# Altium schematic sheet energy_router_#2_hybrid.SchDoc
size A4
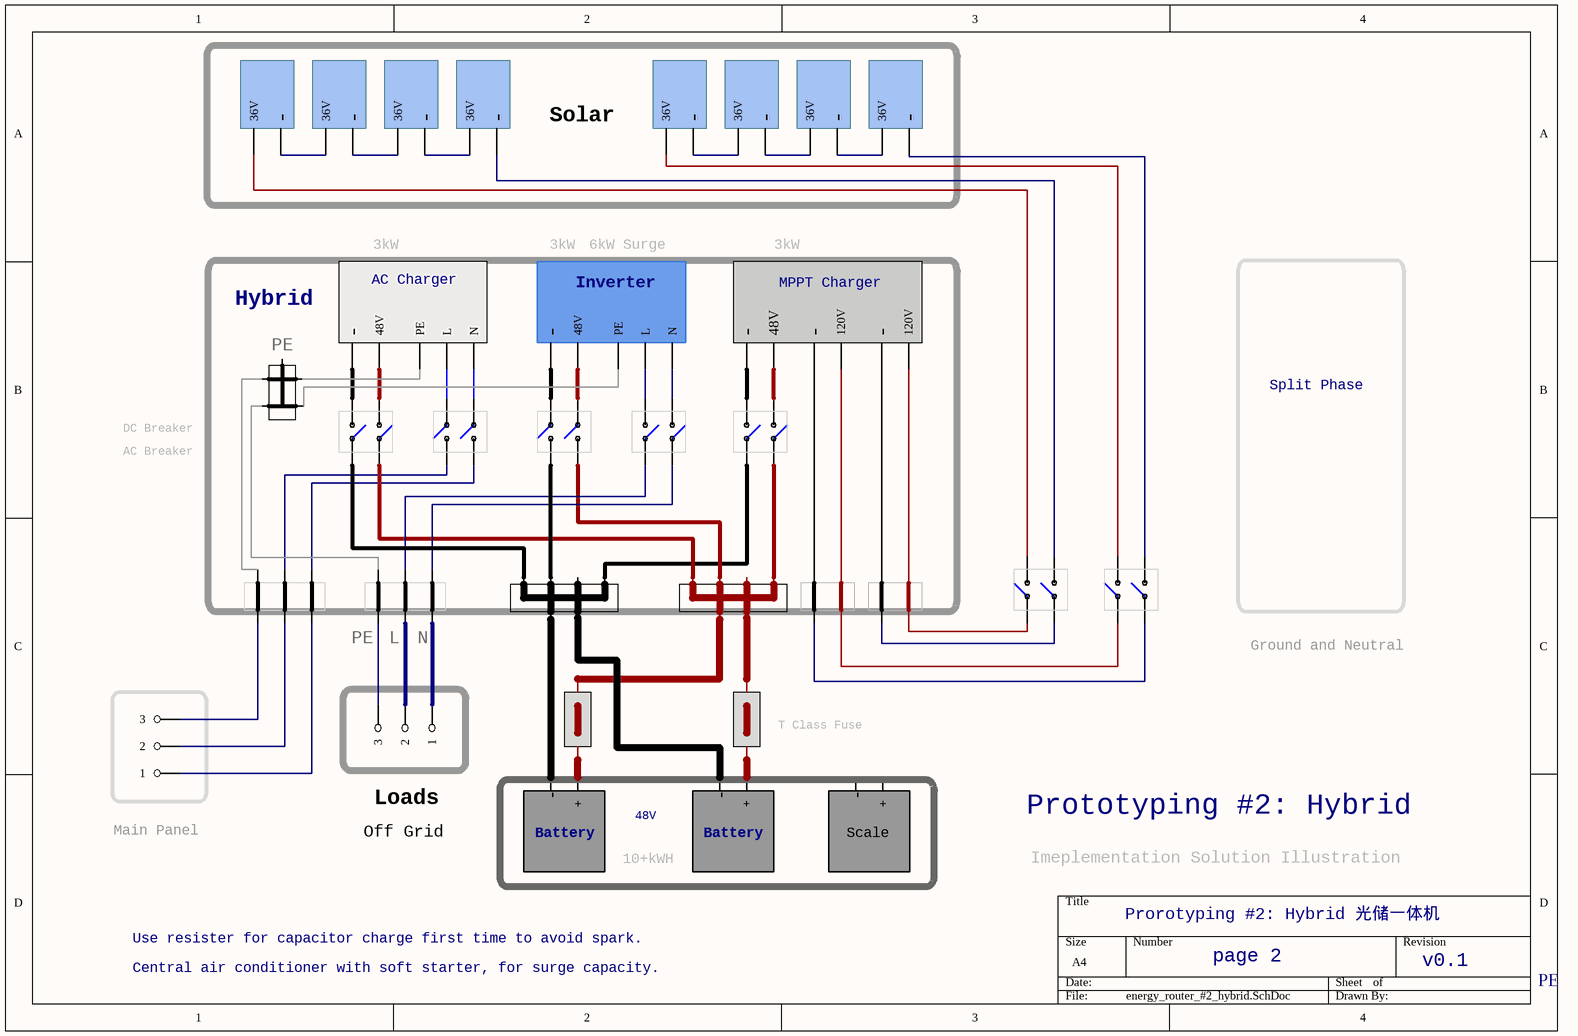
[diagram p0: energy_router_#2_hybrid.SchDoc]

## Parts
(Parts that share a designator on the sheet are numbered #1, #2 ... from top to bottom, then left to right.)
B1022  3_Bus_Bar_Black  (value not drawn)
B1293  3_Bus_Bar_Red  (value not drawn)
Battery1022  48V Battery  (value not drawn)
Battery?  48V Battery  (value not drawn)
F1039  3_Fuse_1_Red  (value not drawn)
I1203  0_Inverter_side  (value not drawn)
JP1102  3 HEADER  (value not drawn)
JP1203  3 HEADER  (value not drawn)
K003  3_Switch_2_box_narrow  (value not drawn)
K039  3_Switch_2_box_reverse_narrow  (value not drawn)
K380  3_Switch_2_box_narrow  (value not drawn)
K946  3_Switch_2_box_reverse_narrow  (value not drawn)
K1023  3_Switch_2_box_reverse_narrow  (value not drawn)
K1039  3_Switch_2_box_reverse_narrow  (value not drawn)
K1043  3_Switch_2_box_reverse_narrow  (value not drawn)
S1023  Solar Panel  (value not drawn)
S1029  Solar Panel  (value not drawn)
S1234  Solar Panel  (value not drawn)
S1704  Solar Panel  (value not drawn)
S1902  Solar Panel  (value not drawn)
S1912  Solar Panel  (value not drawn)
S1923  Solar Panel  (value not drawn)
S1945  Solar Panel  (value not drawn)
Scale  1_BAT_48V  (value not drawn)
T028  3_Bus_Bar_PE  (value not drawn)
T1234  4_Terminal_2_Red_Black  (value not drawn)
T1238  4_Terminal_2_Red_Black  (value not drawn)
U1287  3_Fuse_1_Red  (value not drawn)
U1297  4_Terminal_3  (value not drawn)
U2391  4_Terminal_3  (value not drawn)
U?#1  0_MPPT_Charger_120V_side  (value not drawn)
U?#2  0_AC_Charger_48V_side  (value not drawn)

## Blocks framed on the sheet
Solar: S1023 S1029 S1234 S1704 S1902 S1912 S1923 S1945
Hybrid: B1022 B1293 I1203 K039 K946 K1023 K1039 K1043 T028 T1234 T1238 U1297 U2391 U?#1 U?#2

## Nets
NetB1022_1: B1022.1 K1039.3
NetB1022_2: B1022.2 Battery?.1(-)
NetB1022_3: B1022.3 K1023.2
NetB1022_4: B1022.4 K946.2
NetB1022_6: B1022.6 Battery1022.1(-)
NetB1293_1: B1293.1 K1039.4
NetB1293_2: B1293.2 F1039.1
NetB1293_3: B1293.3 K1023.1
NetB1293_4: B1293.4 K946.1
NetB1293_6: B1293.6 U1287.1
NetBattery1022_2: Battery1022.2(+) U1287.2
NetBattery?_2: Battery?.2(+) F1039.2
NetI1203_1: I1203.1(N) K039.3
NetI1203_2: I1203.2(L) K039.4
NetI1203_3: I1203.3(PE) T028.6
NetI1203_4: I1203.4(-) K1039.1
NetI1203_5: I1203.5(48V) K1039.2
NetJP1102_1: JP1102.1 U2391.2
NetJP1102_2: JP1102.2 U2391.2
NetJP1102_3: JP1102.3 U2391.2
NetJP1203_1: JP1203.1 U1297.2
NetJP1203_2: JP1203.2 U1297.2
NetJP1203_3: JP1203.3 U1297.2
NetK003_1: K003.1 S1023.2(36V)
NetK003_2: K003.2 S1912.1(-)
NetK003_3: K003.3 T1238.1
NetK003_4: K003.4 T1238.1
NetK039_1: K039.1 U1297.1
NetK039_2: K039.2 U1297.1
NetK380_1: K380.1 S1902.2(36V)
NetK380_2: K380.2 S1704.1(-)
NetK380_3: K380.3 T1234.1
NetK380_4: K380.4 T1234.1
NetK946_3: K946.3 U?#1.2(48V)
NetK946_4: K946.4 U?#1.1(-)
NetK1023_3: K1023.3 U?#2.5(48V)
NetK1023_4: K1023.4 U?#2.4(-)
NetK1043_1: K1043.1 U?#2.2(L)
NetK1043_2: K1043.2 U?#2.1(N)
NetK1043_3: K1043.3 U2391.1
NetK1043_4: K1043.4 U2391.1
NetS1023_1: S1023.1(-) S1029.2(36V)
NetS1029_1: S1029.1(-) S1234.2(36V)
NetS1234_1: S1234.1(-) S1912.2(36V)
NetS1704_2: S1704.2(36V) S1945.1(-)
NetS1902_1: S1902.1(-) S1923.2(36V)
NetS1923_1: S1923.1(-) S1945.2(36V)
NetT028_1: T028.1 U1297.1
NetT028_2: T028.2 U?#2.3(PE)
NetT028_5: T028.5 U2391.1
NetT1234_2: T1234.2 U?#1.5(120V)
NetT1234_2: T1234.2 U?#1.4(-)  [a separate net that carries the same name]
NetT1238_2: T1238.2 U?#1.7(120V)
NetT1238_2: T1238.2 U?#1.6(-)  [a separate net that carries the same name]

Not connected (* = marked no-connect by the designer): B1022 5; B1293 5; Scale 1(-) 2(+); T028 4

## Notes on the sheet
- 3kW
- 6kW Surge
- AC Charger
- (near I1203) Inverter
- (near U?#1) MPPT Charger
- (near T028) PE
- DC Breaker
- Split Phase
- AC Breaker
- (near U1297) PE
- (near U1297) L
- (near U1297) N
- Ground and Neutral
- (near F1039) T Class Fuse
- (near JP1102) Main Panel
- Off Grid
- Loads
- (near Battery1022) Battery
- 48V
- (near Battery?) Battery
- (near Scale) Scale
- Prototyping #2: Hybrid
- 10+kWH
- Imeplementation Solution Illustration
- Prorotyping #2: Hybrid 光储一体机
- Central air conditioner with soft starter, for surge capacity.
- Use resister for capacitor charge first time to avoid spark.
- page 2
- v0.1
- PE

## Library data of the parts
Battery1022 Battery? = 1_BAT_48V
JP1102 JP1203 = 3 HEADER: 3 Pin Header
S1023 S1029 S1234 S1704 S1902 S1912 S1923 S1945 = 0_Solar_Panel_36V_narrow